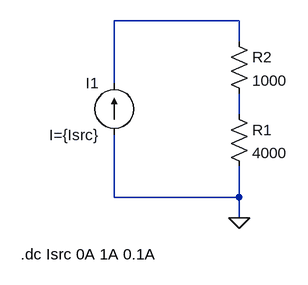
[diagram p0: schematic Draft1.asc]
Draft1.asc, the LTspice schematic file:
Version 4
SHEET 1 880 680
WIRE 256 32 64 32
WIRE 256 64 256 32
WIRE 64 128 64 32
WIRE 256 176 256 144
WIRE 64 304 64 208
WIRE 256 304 256 256
WIRE 256 304 64 304
WIRE 256 336 256 304
FLAG 256 336 0
SYMBOL res 240 160 R0
SYMATTR InstName R1
SYMATTR Value 4000
SYMBOL res 240 48 R0
SYMATTR InstName R2
SYMATTR Value 1000
SYMBOL current 64 208 R180
WINDOW 0 24 80 Left 2
WINDOW 3 24 0 Left 2
WINDOW 123 0 0 Left 0
WINDOW 39 0 0 Left 0
SYMATTR InstName I1
SYMATTR Value I={Isrc}
TEXT -80 392 Left 2 !.dc Isrc 0A 1A 0.1A

The netlist it stands for:
* Draft1.asc
R1 N002 0 4000
R2 N001 N002 1000
I1 0 N001 I={Isrc}
.dc Isrc 0A 1A 0.1A
.backanno
.end